# Altium schematic sheet 原理图22.schdoc
size 309 x 223 mm; Symbol: Sheet-Symbol_A4; Device: Sheet-Symbol_A4; Company: 嘉立创EDA; Version: V1.0; Page Size: A4; @Project Name: 22.STM32智能宠物喂食系统(升级版); @Page Count: 1; @Update Date: 2025-09-16; @Create Date: 2025-01-18; @Schematic Name: STM32智能宠物喂食系统(升级版)_BG1; @Page No: 1; @Page Name: STM32智能宠物喂食系统(升级版)_BG1; @Board Name: STM32智能宠物喂食系统(升级版)_BG1; @Create Time: 17:30:13; @Update Time: 15:20:29
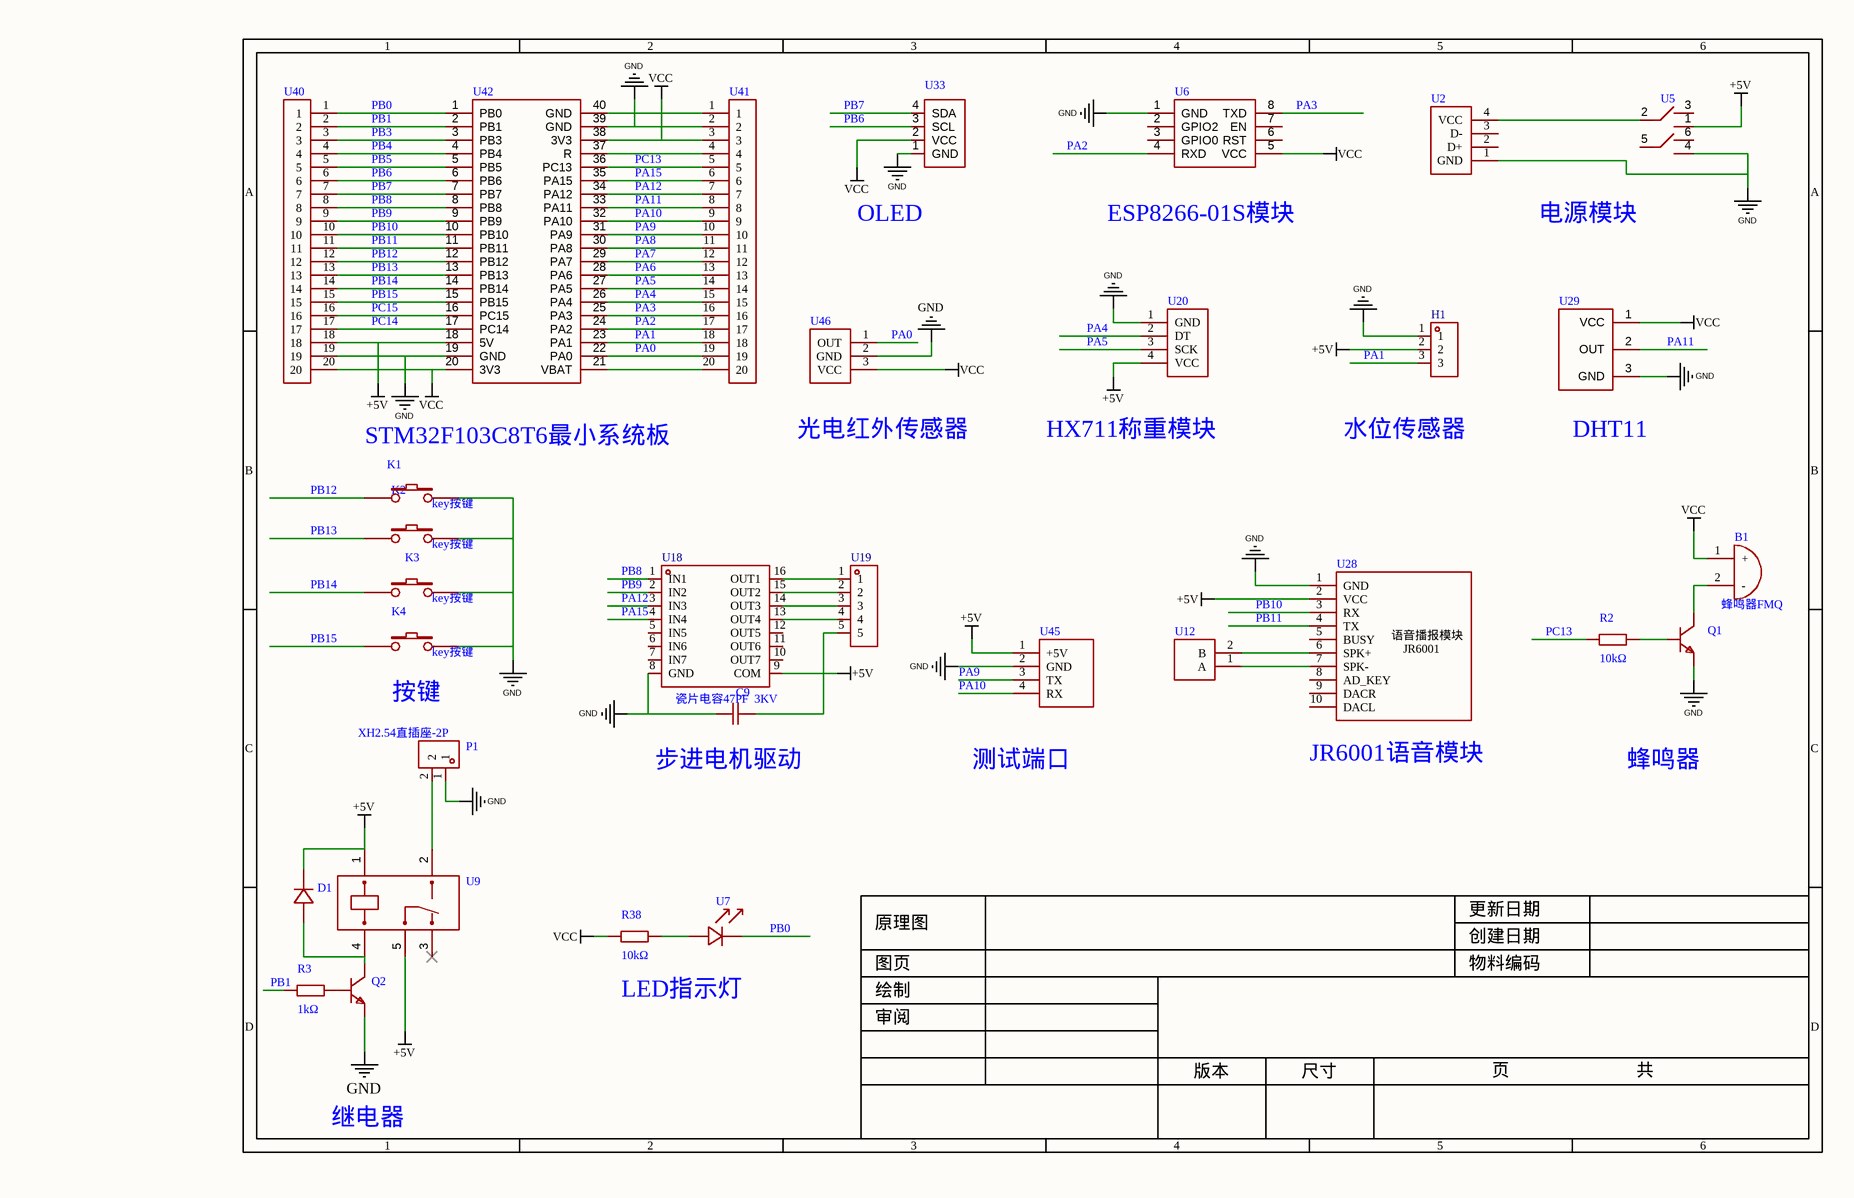
[diagram p0: 原理图22.schdoc]

## Parts
B1  蜂鸣器FMQ  [蜂鸣器]
C9  瓷片电容47PF  3KV  [CAP-TH_L5.0-W4.0-P5.00-D1.0]
D1  (no value)  [DO_1N4007]
H1  (no value)  [HDR-TH_3P-P2.54-V-M]
K1  key按键  [按键]
K2  key按键  [按键]
K3  key按键  [按键]
K4  key按键  [按键]
P1  XH2.54直插座-2P  [CONN-TH_XH2.54-2P]
Q1  (no value)  [S8050_TO_92]
Q2  (no value)  [S8050_TO_92]
R2  10kΩ  [Res_1/4W]
R3  1kΩ  [Res_1/4W]
R38  10kΩ  [Res_1/4W]
U2  (no value)  [USB-TYPEC模块]
U5  (no value)  [按键开关7×7]
U6  (no value)  [ESP8266-01S模块]
U7  (no value)  [LED_5mm]
U9  (no value)  [C2.继电器5V]
U12  (no value)  [两线驱动焊盘]
U18  (no value)  [C1-1.ULN2003步进电机驱动]
U19  XH2.54_5p_DIP端子座  [CONN-TH_5P-P2.54_XH2.54_5P_DIP]  (value not drawn)
U20  (no value)  [HX711]
U28  (no value)  [JR6001语音模块]
U29  (no value)  [DHT11]
U33  (no value)  [D1.OLED四针0.96寸]
U40  (no value)  [1×20排针]
U41  (no value)  [1×20排针]
U42  (no value)  [A1.STM32F103C8T6最小系统板-N]
U45  (no value)  [串口调试接口]
U46  (no value)  [B5.光电红外传感器]

## Nets
+5V: C9.2 D1.1(K) H1.2 U5.1 U9.1 U9.5 U18.9(COM) U19.5 U20.4(VCC) U28.2(VCC) U40.18 U42.18(5V) U45.1(+5V)
GND: C9.1 H1.1 K1.2 K2.2 K3.2 K4.2 P1.1 Q1.1(E) Q2.1(E) U2.1(GND) U5.4 U6.1(GND) U18.8(GND) U20.1(GND) U28.1(GND) U29.3(GND) U33.1(GND) U40.19 U41.1 U41.2 U42.19(GND) U42.39(GND) U42.40(GND) U45.2(GND) U46.2(GND)
VCC: B1.1(+) R38.1 U6.5(VCC) U29.1(VCC) U33.2(VCC) U40.20 U41.3 U42.20(3V3) U42.38(3V3) U46.3(VCC)
PA0: U41.19 U42.22(PA0) U46.1(OUT)
PA1: H1.3 U41.18 U42.23(PA1)
PA2: U6.4(RXD) U41.17 U42.24(PA2)
PA3: U6.8(TXD) U41.16 U42.25(PA3)
PA4: U20.2(DT) U41.15 U42.26(PA4)
PA5: U20.3(SCK) U41.14 U42.27(PA5)
PA6: U41.13 U42.28(PA6)
PA7: U41.12 U42.29(PA7)
PA8: U41.11 U42.30(PA8)
PA9: U41.10 U42.31(PA9) U45.3(TX)
PA10: U41.9 U42.32(PA10) U45.4(RX)
PA11: U29.2(OUT) U41.8 U42.33(PA11)
PA12: U18.3(IN3) U41.7 U42.34(PA12)
PA15: U18.4(IN4) U41.6 U42.35(PA15)
PB0: U7.1(C) U40.1 U42.1(PB0)
PB1: R3.1 U40.2 U42.2(PB1)
PB3: U40.3 U42.3(PB3)
PB4: U40.4 U42.4(PB4)
PB5: U40.5 U42.5(PB5)
PB6: U33.3(SCL) U40.6 U42.6(PB6)
PB7: U33.4(SDA) U40.7 U42.7(PB7)
PB8: U18.1(IN1) U40.8 U42.8(PB8)
PB9: U18.2(IN2) U40.9 U42.9(PB9)
PB10: U28.3(RX) U40.10 U42.10(PB10)
PB11: U28.4(TX) U40.11 U42.11(PB11)
PB12: K1.1 U40.12 U42.12(PB12)
PB13: K2.1 U40.13 U42.13(PB13)
PB14: K3.1 U40.14 U42.14(PB14)
PB15: K4.1 U40.15 U42.15(PB15)
PC13: R2.1 U41.5 U42.36(PC13)
PC14: U40.17 U42.17(PC14)
PC15: U40.16 U42.16(PC15)
NetB1_2: B1.2(-) Q1.3(C)
NetD1_2: D1.2(A) Q2.3(C) U9.4
NetP1_2: P1.2 U9.2
NetQ1_2: Q1.2(B) R2.2
NetQ2_2: Q2.2(B) R3.2
NetR38_2: R38.2 U7.2(A)
NetU2_4: U2.4(VCC) U5.2
NetU12_1: U12.1(A) U28.7(SPK-)
NetU12_2: U12.2(B) U28.6(SPK+)
NetU18_13: U18.13(OUT4) U19.4
NetU18_14: U18.14(OUT3) U19.3
NetU18_15: U18.15(OUT2) U19.2
NetU18_16: U18.16(OUT1) U19.1
NetU41_4: U41.4 U42.37(R)
NetU41_20: U41.20 U42.21(VBAT)

Not connected (* = marked no-connect by the designer): U2 2(D+) 3(D-); U5 3 5 6; U6 2(GPIO2) 3(GPIO0) 6(RST) 7(EN); U9 3*; U18 5(IN5) 6(IN6) 7(IN7) 10(OUT7) 11(OUT6) 12(OUT5); U28 5(BUSY) 8(AD_KEY) 9(DACR) 10(DACL)

## Notes on the sheet
- (near U33) OLED
- (near U6) ESP8266-01S模块
- 电源模块
- STM32F103C8T6最小系统板
- (near U46) 光电红外传感器
- HX711称重模块
- 水位传感器
- (near U29) DHT11
- (near K4) 按键
- (near C9) 步进电机驱动
- 测试端口
- (near U28) JR6001语音模块
- 蜂鸣器
- LED指示灯
- 继电器
- 1
- 2
- 3
- 4
- 5
- 6
- A
- B
- C
- 原理图
- 创建日期
- 更新日期
- 审阅
- 绘制
- 图页
- 物料编码
- D
- 版本
- 尺寸
- 页
- 共
- (in symbol JR6001语音模块) 语音播报模块 / JR6001

## Library data of the parts
B1 = 蜂鸣器FMQ: Add into BOM: yes; Symbol: 蜂鸣器FMQ; Device: 蜂鸣器FMQ; Convert to PCB: yes
C9 = 瓷片电容47PF  3KV: Symbol: Ceramic capacitors47PF 3KV; Add into BOM: yes; Device: 瓷片电容47PF  3KV; LCSC Part Name: 47pF(47R) ±10% 3KV; Supplier Part: C19375; Manufacturer Part: 瓷片电容47PF  3KV; Supplier Footprint: Through Hole; JLCPCB Part Class: 扩展库; Datasheet: https://atta.szlcsc.com/upload/public/pdf/source/20151026/1457707498987.pdf; Supplier: LCSC; Convert to PCB: yes
D1 = D_1N4007A: Add into BOM: yes; Symbol: D_1N4007; Device: D_1N4007A; Supplier Footprint: DO-41; Convert to PCB: yes
H1 = HDR-M_2.54_1x3P: Symbol: PZ254V-11-03P_C2937625; Convert to PCB: yes; Device: HDR-M_2.54_1x3P; Add into BOM: yes; Supplier Part: C2937625; Supplier Footprint: 插件
K1-K4 = key按键: Add into BOM: yes; Symbol: key按键; Device: key按键; Convert to PCB: yes
P1 = XH2.54直插座-2P: Add into BOM: yes; Symbol: XH2.54直插座-2P; Device: XH2.54直插座-2P; LCSC Part Name: XH2.54直插座-2P; Supplier Part: C9900016957; Manufacturer Part: XH2.54直插座-2P; Supplier Footprint: XH2.54-2; JLCPCB Part Class: 扩展库; Datasheet: https://atta.szlcsc.comnull; Supplier: LCSC; Convert to PCB: yes
Q1 = S8050_TO_NPN: Convert to PCB: yes; Symbol: S8050_TO_NPN; Device: S8050_TO_NPN; Add into BOM: yes; Supplier Footprint: TO-92
Q2 = 三极管直插S8050_TO_NPN: Convert to PCB: yes; Symbol: 三极管直插S8050_TO_NPN; Device: 三极管直插S8050_TO_NPN; Add into BOM: yes; Supplier Footprint: TO-92
R2 R3 R38 = Res_AXIAL-1/4W: Symbol: 电阻; Add into BOM: yes; Device: Res_AXIAL-1/4W; Supplier Footprint: 轴向引线; Convert to PCB: yes
  R2 R38: Value: 10kΩ
  R3: Value: 1kΩ
U2 = USB-TYPEC模块: Add into BOM: yes; Symbol: USB-TYPEC模块; Device: USB-TYPEC模块; Convert to PCB: yes
U5 = 按键开关7×7: Symbol: 按键开关7*7; Add into BOM: yes; Device: 按键开关7×7; Convert to PCB: yes
U6 = ESP8266-01S模块: Add into BOM: yes; Symbol: ESP8266-01S模块; Device: ESP8266-01S模块; Convert to PCB: yes
U7 = LED_5mm: Add into BOM: yes; Symbol: LED_5mm; Device: LED_5mm; Convert to PCB: yes
U9 = C2.继电器5V: Symbol: 继电器5V; Add into BOM: yes; Device: C2.继电器5V; Convert to PCB: yes
U12 = 两线驱动焊盘: Add into BOM: yes; Symbol: 两线驱动焊盘; Device: 两线驱动焊盘; Convert to PCB: yes
U18 = C1-1.ULN2003步进电机驱动: Symbol: ULN2003A_C93000; Add into BOM: yes; Device: C1-1.ULN2003步进电机驱动; Convert to PCB: yes
U19 = XH2.54_5P端子: Symbol: Header5; Add into BOM: yes; Device: XH2.54_5P端子; LCSC Part Name: XH2.54_5p_DIP端子座; Supplier Part: C9900014194; Manufacturer Part: XH2.54_5p_DIP端子座; Supplier Footprint: XH2.54_5p_DIP端子座; JLCPCB Part Class: 扩展库; Datasheet: https://atta.szlcsc.comnull; Supplier: LCSC; Convert to PCB: yes
U20 = HX711: Add into BOM: yes; Symbol: HX711; Device: HX711; Convert to PCB: yes
U28 = JR6001语音模块: Add into BOM: yes; Symbol: JR6001语音模块; Device: JR6001语音模块; Convert to PCB: yes
U29 = DHT11温湿度传感器: Add into BOM: yes; Symbol: DHT11温湿度传感器; Device: DHT11温湿度传感器; Convert to PCB: yes
U33 = D1.OLED4针0.96寸: Symbol: OLED四针0.96寸; Add into BOM: yes; Device: D1.OLED4针0.96寸; Convert to PCB: yes
U40 U41 = 1×20PIN排针: Add into BOM: yes; Symbol: 1×20PIN排针; Device: 1×20PIN排针; Convert to PCB: yes
U42 = A1.STM32F103C8T6最小系统板-N: Add into BOM: yes; Symbol: A1.STM32F103C8T6最小系统板-N; Device: A1.STM32F103C8T6最小系统板-N; Convert to PCB: yes
U45 = 串口调试接口: Add into BOM: yes; Symbol: 串口调试接口; Device: 串口调试接口; Convert to PCB: yes
U46 = B5.光电红外传感器: Add into BOM: yes; Symbol: B5.光电红外传感器; Device: B5.光电红外传感器; Convert to PCB: yes